# EasyEDA schematic SCH_Eagle-Blinkyy_2025-12-08.json
TITLE: Sheet_1; REV: 1.0; Date: 2025-12-08; Sheet: 1/1; Drawn By: maxmelvin2010; Company: Your Company
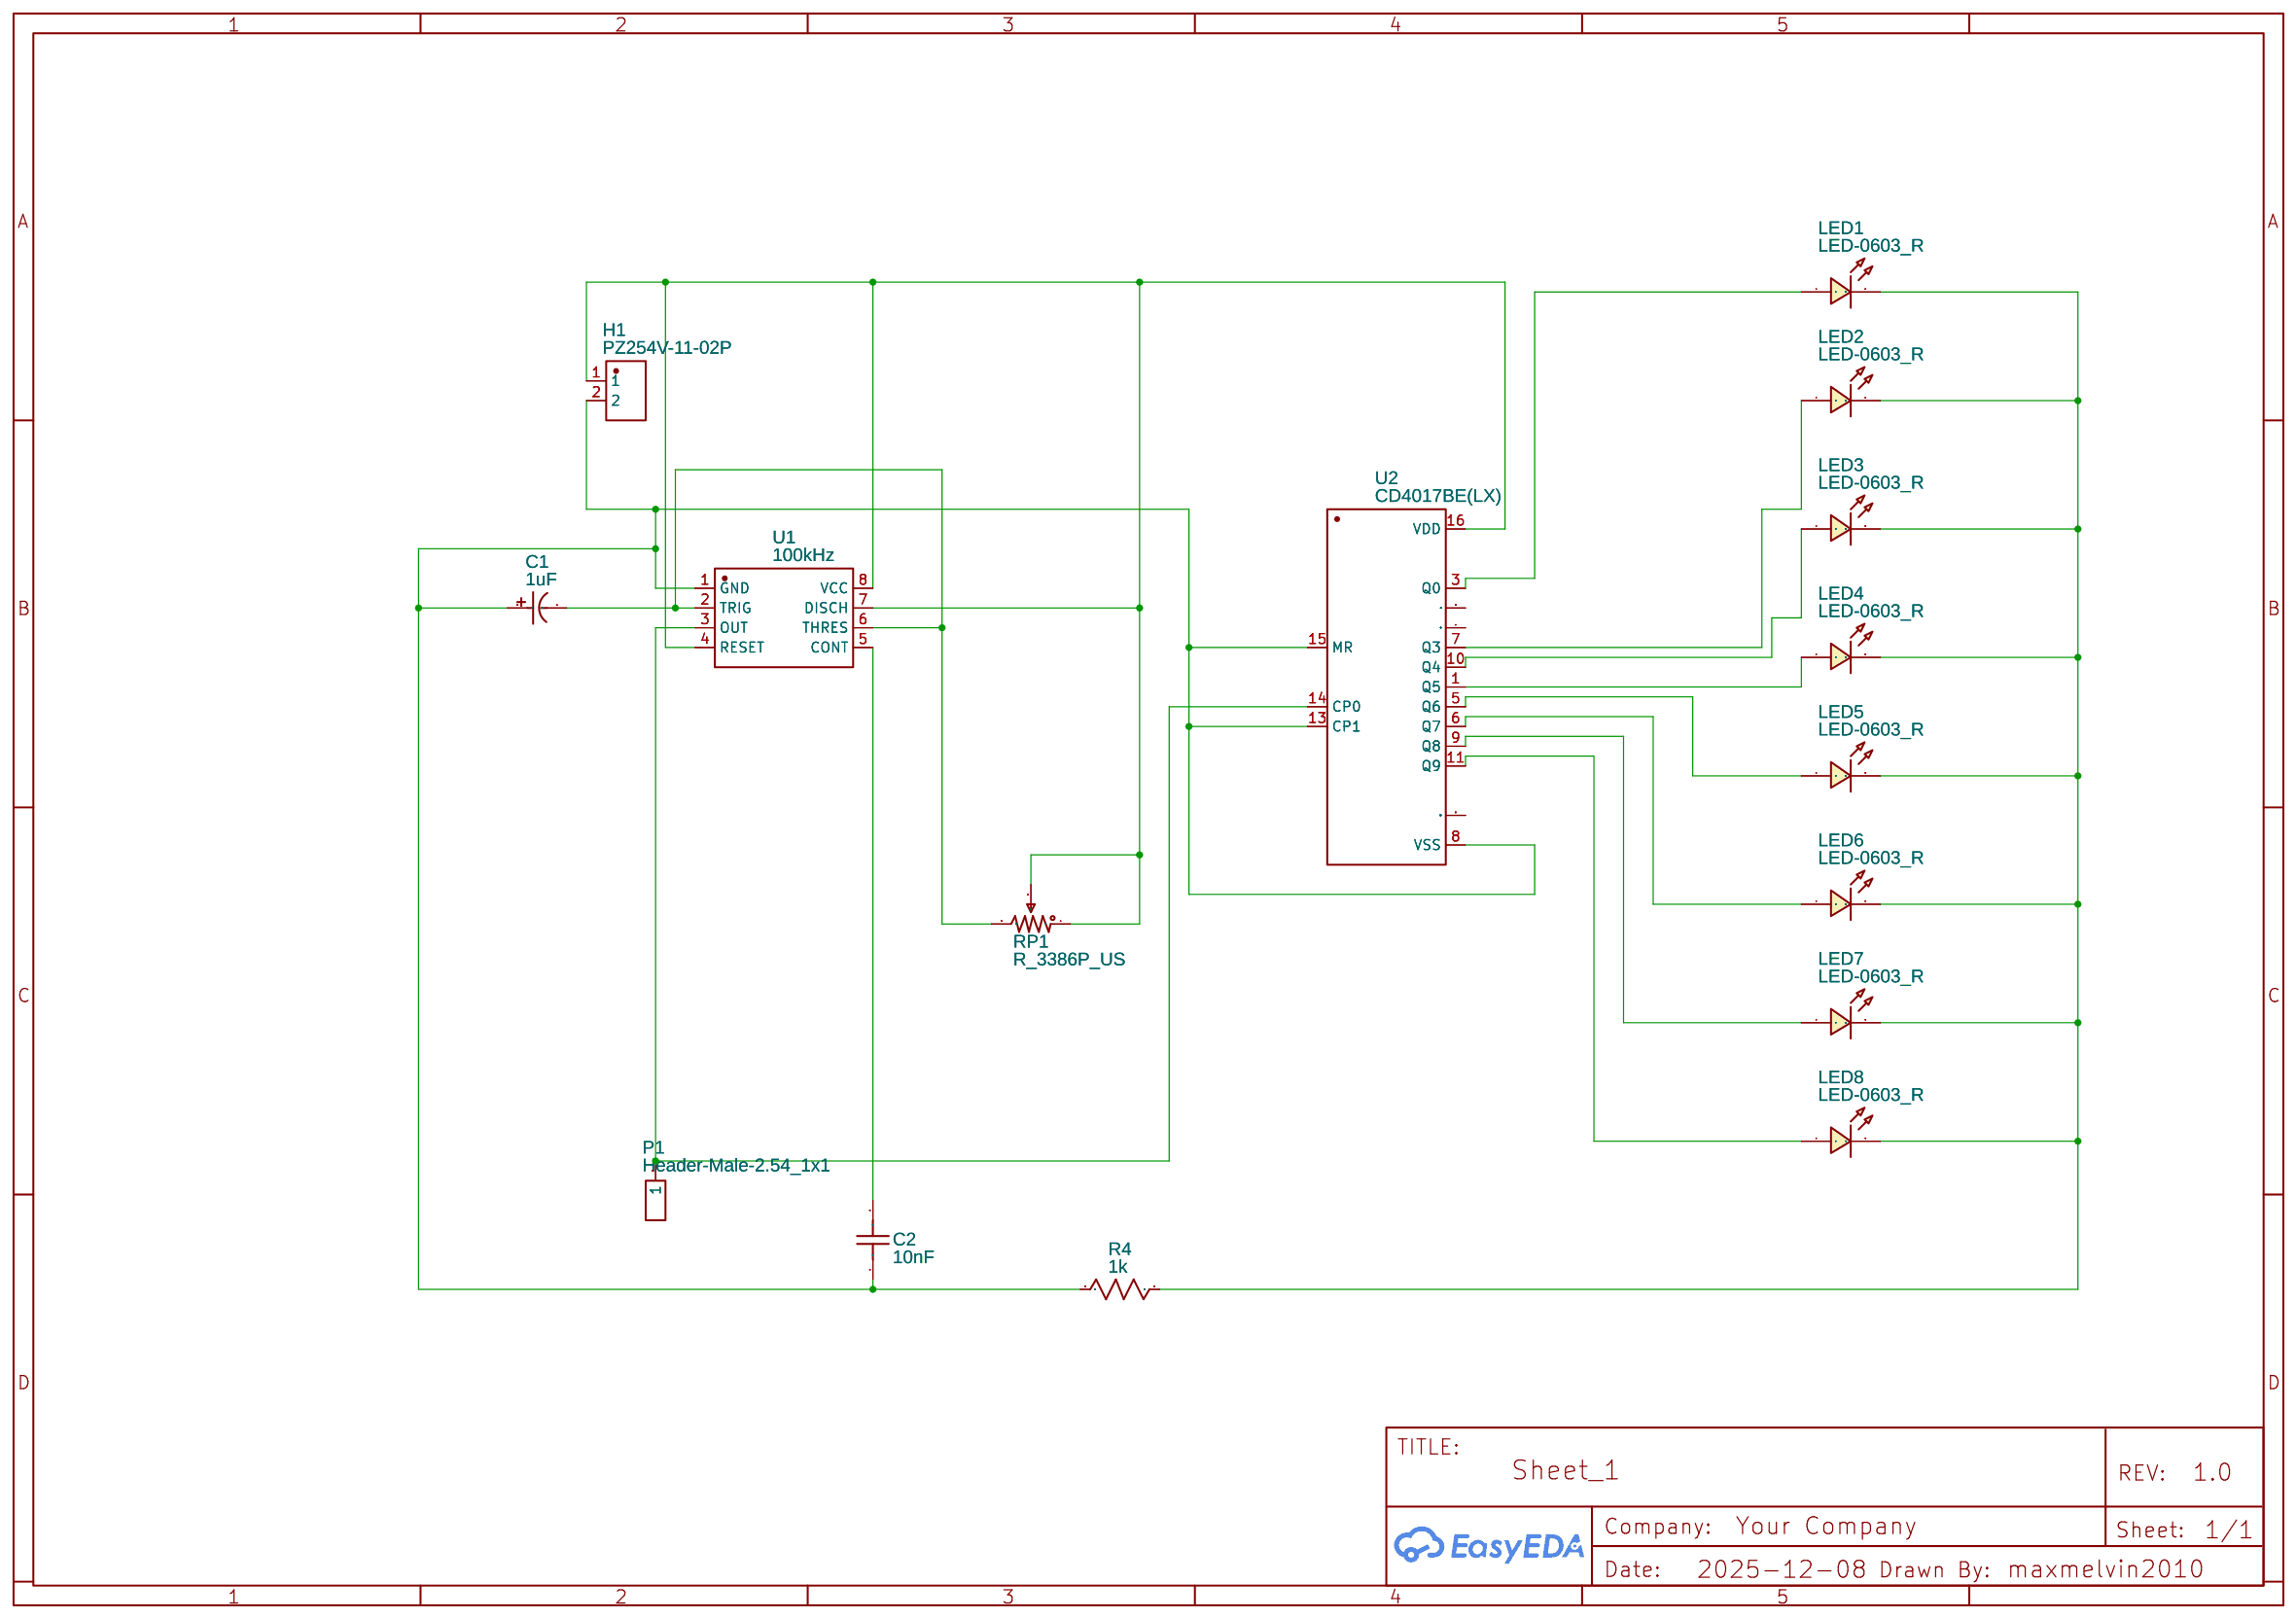
[diagram p0: schematic sheet]

## Parts
C1  1uF  [CAP-TH_BD5.0-P2.00-D0.8-FD]
C2  10nF  [CAP-TH_L8.0-W4.0-P5.00-D1.2]
H1  PZ254V-11-02P  [HDR-TH_2P-P2.54-V-M]
LED1  LED-0603_R  [LED0603_RED]
LED2  LED-0603_R  [LED0603_RED]
LED3  LED-0603_R  [LED0603_RED]
LED4  LED-0603_R  [LED0603_RED]
LED5  LED-0603_R  [LED0603_RED]
LED6  LED-0603_R  [LED0603_RED]
LED7  LED-0603_R  [LED0603_RED]
LED8  LED-0603_R  [LED0603_RED]
P1  Header-Male-2.54_1x1  [HDR-TH_1P-P2.54-V-M]
R4  1k  [R1206]
RP1  R_3386P_US  [RES-ADJ-TH_3386P]
U1  100kHz  [DIP-8_L9.8-W6.6-P2.54-LS7.6-BL]
U2  CD4017BE(LX)  [PDIP-16_L19.3-W6.4-P2.54-LS7.94-BL]

## Library data of the parts
C1 = KF010M050C110A: Supplier: LCSC; Manufacturer: CapXon(丰宾); Supplier Part: C62934; JLCPCB Part Class: Extended Part
C2 = N09F1B103MN0B0S0N0: Contributor: LCSC; Supplier: LCSC; Supplier Part: C249157; Manufacturer: STE(松田); JLCPCB Part Class: Extended Part
H1 = PZ254V-11-02P: Contributor: LCSC; Supplier: LCSC; Supplier Part: C492401; Manufacturer: XFCN(兴飞); JLCPCB Part Class: Extended Part
LED1-LED8 = LED-0603_R: Manufacturer: EVERLIGHT(台湾亿光); Manufacturer Part: 19-217/R6C-AL1M2VY/3T; Supplier Part: C72044; Supplier: LCSC; Contributor: LCEDA_01
P1 = Header-Male-2.54_1x1: Supplier: LCSC; Manufacturer: BOOMELE(博穆精密); Manufacturer Part: 2.54-1*1P针; Supplier Part: C81276; JLCPCB Part Class: Extended Part
R4 = R_1206_US: Contributor: LCEDA_Lib
RP1 = R_3386P_US: Supplier: LCSC; Contributor: LCEDA_Lib; value(Ω): 10K
U1 = NE555P: Supplier: LCSC; Manufacturer: TI(德州仪器); Supplier Part: C46749; JLCPCB Part Class: Extended Part
U2 = CD4017BE(LX): Supplier: LCSC; Supplier Part: C32710674; Manufacturer: LX(灵星芯微); Contributor: lcsc; JLCPCB Part Class: Extended Part

## Nets
Net-(C1-1): C1.1 C2.1 H1.2 R4.1 U1.1(GND) U2.8(VSS) U2.13(CP1) U2.15(MR)
Net-(C1-2): C1.2 RP1.3 U1.2(TRIG) U1.6(THRES)
Net-(C2-2): C2.2 U1.5(CONT)
Net-(H1-1): H1.1 RP1.1 RP1.2 U1.4(RESET) U1.7(DISCH) U1.8(VCC) U2.16(VDD)
Net-(LED1-1): LED1.1 U2.3(Q0)
Net-(LED1-2): LED1.2 LED2.2 LED3.2 LED4.2 LED5.2 LED6.2 LED7.2 LED8.2 R4.2
Net-(LED2-1): LED2.1 U2.7(Q3)
Net-(LED3-1): LED3.1 U2.10(Q4)
Net-(LED4-1): LED4.1 U2.1(Q5)
Net-(LED5-1): LED5.1 U2.5(Q6)
Net-(LED6-1): LED6.1 U2.6(Q7)
Net-(LED7-1): LED7.1 U2.9(Q8)
Net-(LED8-1): LED8.1 U2.11(Q9)
Net-(P1-1): P1.1 U1.3(OUT) U2.14(CP0)

Not connected (* = marked no-connect by the designer): U2 2(Q1) 4(Q2) 12(Q5-9)
